# Altium schematic sheet Power_Regulators_RF_2.SchDoc
size A4; DocumentNumber: 36; SheetNumber: 36; SheetTotal: 47
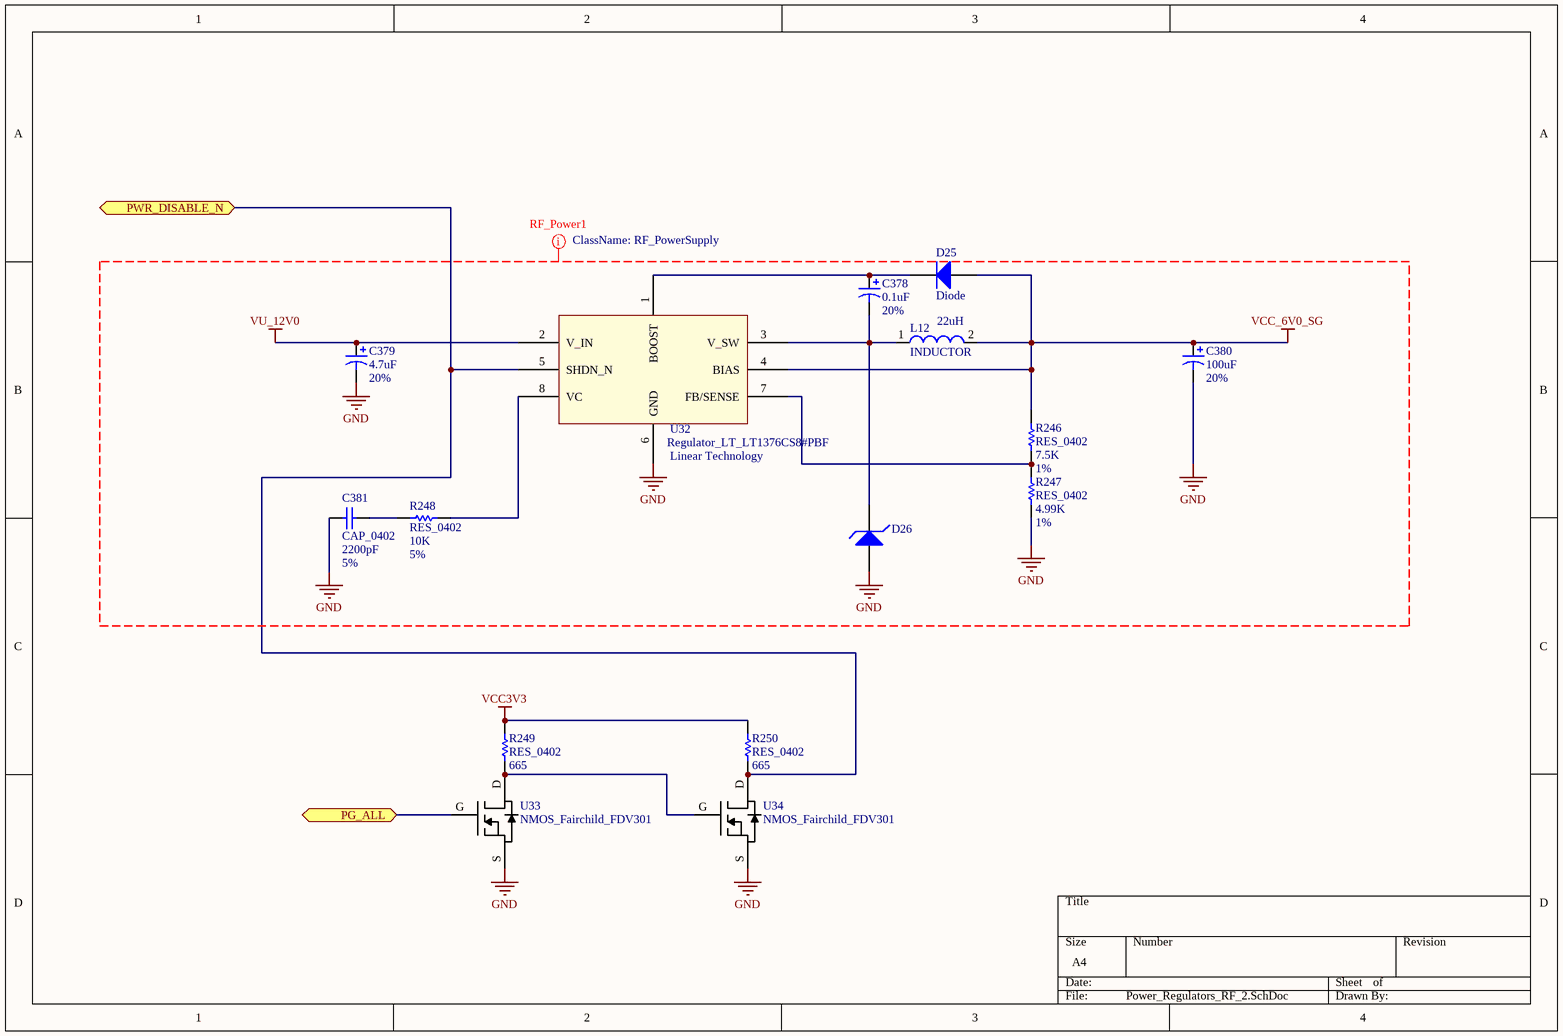
[diagram p0: Power_Regulators_RF_2.SchDoc]

## Parts
C378  value 0.1uF  Tolerance: 20%  [Polarized_CAPC1206(3216)]  (hidden comment: Cap Pol1)
C379  value 4.7uF  Tolerance: 20%  [Polarized_CAPC1206(3216)]  (hidden comment: Cap Pol1)
C380  value 100uF  Tolerance: 20%  [Polarized_CAPC1210(3225)]  (hidden comment: Cap Pol1)
C381  CAP_0402  value 2200pF  Tolerance: 5%  [CAPC0402(1005)60_N]
D25  Diode  [Diode_DB2J31700L_2-PIN]
D26  Shottky Diode  [SchottkyDiode_SS2P2-M384A_2-PIN]  (value not drawn)
L12  INDUCTOR  value 22uH  [Inductor_IHSM4825ER_2-PIN]
R246  RES_0402  value 7.5K  Tolerance: 1%  [RESC0402(1005)_N]
R247  RES_0402  value 4.99K  Tolerance: 1%  [RESC0402(1005)_N]
R248  RES_0402  value 10K  Tolerance: 5%  [RESC0402(1005)_N]
R249  RES_0402  value 665  [RESC0402(1005)_N]
R250  RES_0402  value 665  [RESC0402(1005)_N]
U32  Regulator_LT_LT1376CS8#PBF  Manufacturer: Linear Technology  [LT1376CS8#PBF_8SOIC]
U33  NMOS_Fairchild_FDV301  [NMOS_Fairchild_FDV301_SOT23-3]
U34  NMOS_Fairchild_FDV301  [NMOS_Fairchild_FDV301_SOT23-3]

## Ports
PG_ALL (bidir), PWR_DISABLE_N (bidir)

## Nets
GND: C379.2 C380.2 C381.1 D26.2(A) R247.1 U32.6(GND) U33.S U34.S
VCC3V3: R249.2 R250.2
VCC_6V0_SG: C380.1 D25.2(A) L12.2 R246.2 U32.4(BIAS)
VU_12V0: C379.1 U32.2(V_IN)
PG_ALL: U33.G ; port PG_ALL
PWR_DISABLE_N: R250.1 U32.5(SHDN_N) U34.D ; port PWR_DISABLE_N
NetC378_1: C378.1 D25.1(K) U32.1(BOOST)
NetC378_2: C378.2 D26.1(K) L12.1 U32.3(V_SW)
NetC381_2: C381.2 R248.1
NetR246_1: R246.1 R247.2 U32.7(FB/SENSE)
NetR248_2: R248.2 U32.8(VC)
NetR249_1: R249.1 U33.D U34.G

## Layout directives
net class RF_PowerSupply: GND, VCC_6V0_SG, VU_12V0

## Library data of the parts
C378 = T491A104M035AT: CAP TANT 0.1UF 35V 20% 1206; Manufacturer: Kemet; Part Number: T491A104M035AT; Footprint Ref: Polarized_CAPC1206(3216); Library Ref: Cap Pol1
C379 = T491A475M025AT: CAP TANT 4.7UF 25V 20% 1206; Manufacturer: Kemet; Part Number: T491A475M025AT; Footprint Ref: Polarized_CAPC1206(3216); Library Ref: Cap Pol1
C380 = TLCT107M010XTA: 100uF, tantalum, 20% 10V, 1210; Manufacturer: AVX Corporation; Part Number: TLCT107M010XTA; Footprint Ref: Polarized_CAPC1210(3225); Library Ref: Cap Pol1
C381 = C1005SL1A222J: CAP CER 2200PF 10V 5% SL 0402; Manufacturer: TDK Corporation; Part Number: C1005SL1A222J; Footprint Ref: CAPC0402(1005)60_N; Library Ref: CAP_0402
D25 = DB2J31700L: DIODE 30V 1A SMINI2; Manufacturer: Panasonic Electronic Components - Semiconductor Products; Part Number: DB2J31700L; Footprint Ref: Diode_DB2J31700L_2-PIN; Library Ref: Diode
D26 = SS2P2-M3/84A: DIODE SCHOTTKY 2A 20V SMP; Manufacturer: Vishay Semiconductor Diodes Division; Part Number: SS2P2-M3/84A; Footprint Ref: SchottkyDiode_SS2P2-M384A_2-PIN; Library Ref: ShottkyDiode
L12 = IHSM4825ER2R0L: Surface Mount Inductor,22uH,1.7A; Manufacturer: Vishay Dale; Tolerance: *; Part Number: IHSM4825ER2R0L; Footprint Ref: Inductor_IHSM4825ER_2-PIN; Library Ref: INDUCTOR
R246 = ERJ-2RKF7501X: RES 7.50K OHM 1/10W 1% 0402 SMD; Manufacturer: Panasonic Electronic Components; Part Number: ERJ-2RKF7501X; Footprint Ref: RESC0402(1005)_N; Library Ref: RES_0402
R247 = CRCW04024K99FKED: 4.99K ohm, 1% 1/16W, 0402; Manufacturer: Vishay/Dale; Part Number: CRCW04024K99FKED; Footprint Ref: RESC0402(1005)_N; Library Ref: RES_0402
R248 = RC0402JR-0710KL: 10K ohm, 5%, 1/16W, 0402; Manufacturer: Yageo America; Part Number: RC0402JR-0710KL; Footprint Ref: RESC0402(1005)_N; Library Ref: RES_0402
R249 R250 = ERJ-2RKF6650X: RES 665 OHM 1/10W 1% 0402 SMD; Manufacturer: Panasonic Electronic Components; Tolerance: *; Part Number: ERJ-2RKF6650X; Footprint Ref: RESC0402(1005)_N; Library Ref: RES_0402
U32 = LT1376CS8#PBF: IC REG BUCK ADJ 1.5A 8SOIC; Part Number: LT1376CS8#PBF; Footprint Ref: LT1376CS8#PBF_8SOIC; Library Ref: Regulator_LT_LT1376CS8#PBF
U33 U34 = FDV301N: MOSFET N-CH 25V 220MA SOT-23; Manufacturer: Fairchild Semiconductor; Part Number: FDV301N; Footprint Ref: NMOS_Fairchild_FDV301_SOT23-3; Library Ref: NMOS_Fairchild_FDV301